# EAGLE design integrated (EAGLE 7.5.0)
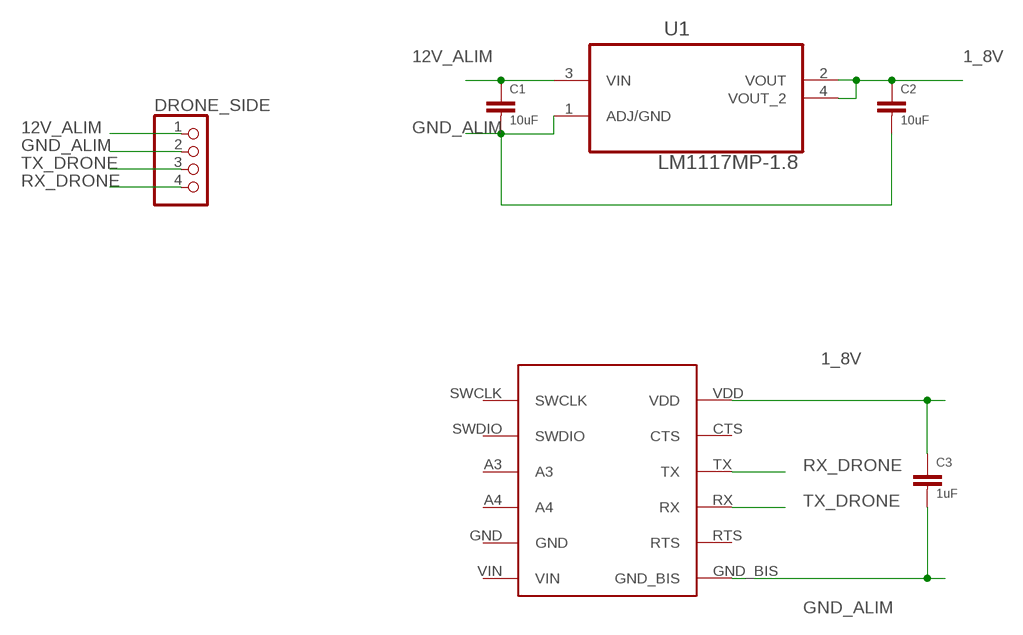
[diagram p0: schematic, sheet 1]

## Parts
C1  10uF  C_0805  [R0805]
C2  10uF  C_0805  [R0805]
C3  1uF  C_1206  [R1206]
DRONE_SIDE  PINHD-1X4  [1X04]
U1  LM1117MP-1.8  [SOT230P696X180-4N]
U$2  BLE_NANO  [MOUNTED_ON_PINHEADS]

## Nets
1_8V: C2.1 C3.1 U1.2(VOUT) U1.4(VOUT_2) U$2.VDD
12V_ALIM: C1.1 DRONE_SIDE.1 U1.3(VIN)
GND_ALIM: C1.2 C2.2 C3.2 DRONE_SIDE.2 U1.1(ADJ/GND) U$2.GND_BIS
RX_DRONE: DRONE_SIDE.4 U$2.TX
TX_DRONE: DRONE_SIDE.3 U$2.RX
Unconnected: U$2.A3 U$2.A4 U$2.CTS U$2.GND U$2.RTS U$2.SWCLK U$2.SWDIO U$2.VIN

## Library data of the parts
C1-C3 = @Club_passif:C_
DRONE_SIDE = pinhead:PINHD-1X4: PIN HEADER
U1 = lm1117:LM1117MP-1.8: IC REG LDO 800MA 1.8V; MPN: LM1117MP-1.8; OC_FARNELL: 1469053; OC_NEWARK: 41K3467; PACKAGE: SOT-223; SUPPLIER: National Semiconductor
U$2 = redbearlab:BLE_NANO

## Board
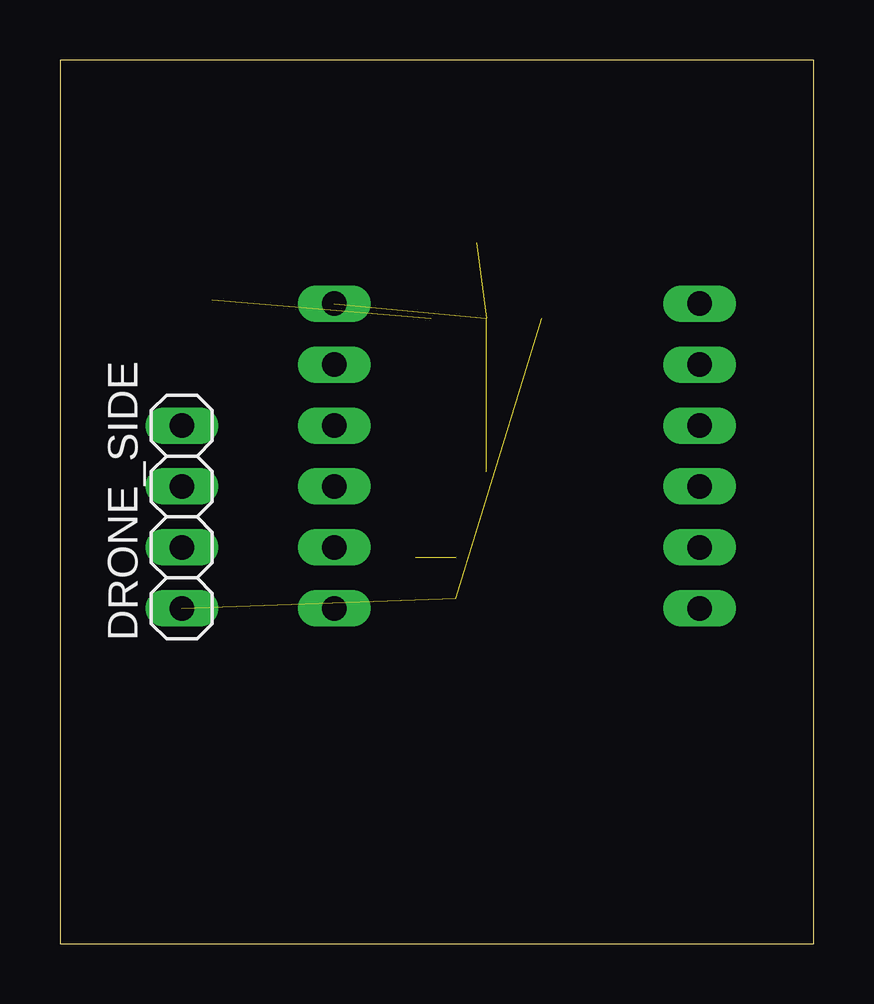
[diagram p1: board, top side]
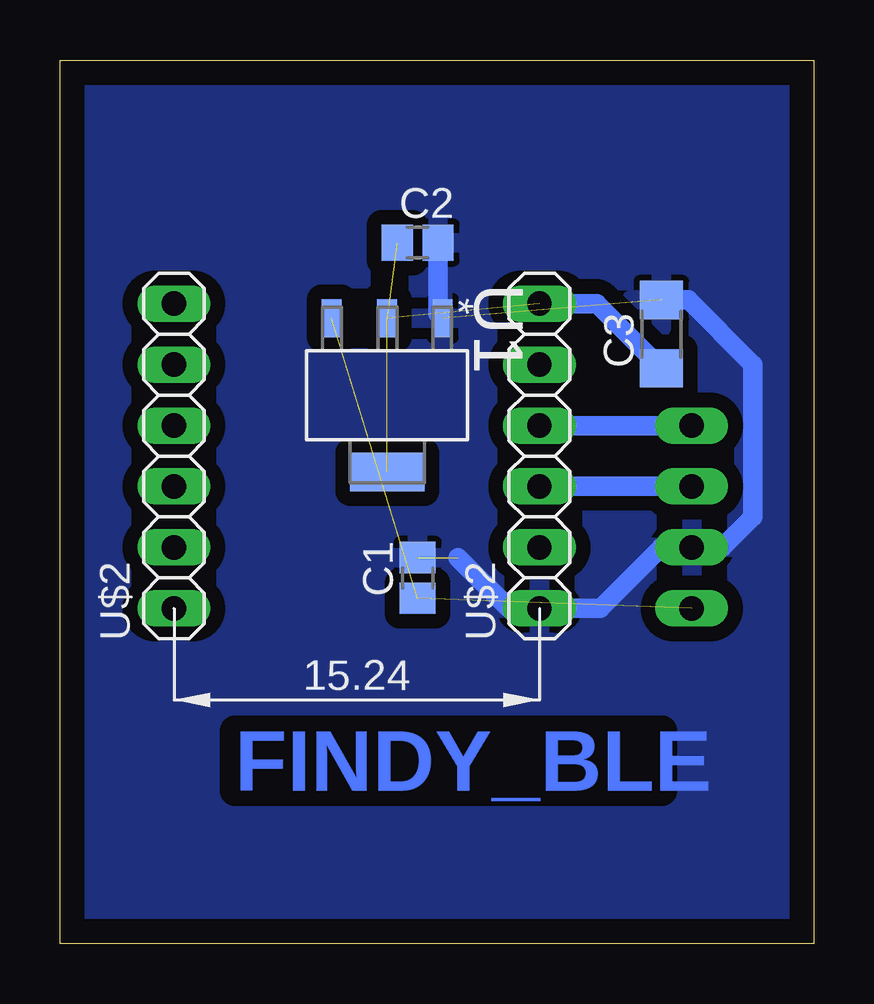
[diagram p2: board, bottom side, seen from below]

Size 31.42 x 36.82 mm. Coordinates in mm from the lower left corner, seen from the top.
Outline: 0,0 31.42,0 31.42,36.82 0,36.82 0,0
Copper layers (1*16): Top 0.035mm / dielectric 1.5mm / Bottom 0.035mm
Design rules "default": minimum track width 10mil, minimum drill 24mil, track to track 8mil, track to pad 8mil, pad to pad 8mil, via to via 8mil, smd to smd 8mil, copper to edge 40mil, drill to drill 8mil, minimum pad ring 10mil, minimum via ring 8mil, stop-mask expansion 4mil, vias tented up to drill 0mil, thermal gap 10mil

### Footprints (pad centres in the part's own frame; a part is rotated, then mirrored left to right if it is on the bottom)
R0805 = smd 1.3 x 1.5: 1 -0.85,0; 2 0.85,0
R1206 = smd 1.6 x 1.803: 1 -1.422,0; 2 1.422,0
1X04 = drill 1.016 long: 1 -3.81,0; 2 -1.27,0; 3 1.27,0; 4 3.81,0
SOT230P696X180-4N = smd 1.6 x 0.838: 1 -3.2,2.311; 2 -3.2,0; 3 -3.2,-2.311 | smd 1.6 x 3.099: 4 3.2,0
MOUNTED_ON_PINHEADS = drill 1.016 long: A3 -7.62,5.08; A4 -7.62,2.54; CTS 7.62,7.62; GND -7.62,0; GND_BIS 7.62,-2.54; RTS 7.62,0; RX 7.62,2.54; SWCLK -7.62,10.16; SWDIO -7.62,7.62; TX 7.62,5.08; VDD 7.62,10.16; VIN -7.62,-2.54

### Placement (x,y rotation side)
C1  16.51,15.24 90 bottom
C2  16.51,29.21 0 bottom
C3  6.35,25.4 90 bottom
DRONE_SIDE  5.08,17.78 90 top
U1  17.78,22.86 270 bottom
U$2  19.05,16.51 0 bottom

### Tracks (layer width: path | path; a pad name or v marks a point on that pad's centre or on a via)
1_8V  (3 unrouted)
  Bottom 0.813: U$2.VDD 9.04,26.67 C3.1
12V_ALIM  (2 unrouted)
GND_ALIM  (2 unrouted)
  Bottom 0.813: C3.2 5.23,26.82 2.54,24.13 2.54,17.78 3.81,16.51 DRONE_SIDE.2 6.35,16.51 8.89,13.97 U$2.GND_BIS 12.7,13.97 14.82,16.09 | C2.2 15.66,26.25 U1.1
  pour Bottom (isolate 0.61): -15.24,44.45 41.91,44.45 41.91,-3.81 -15.24,-3.81
RX_DRONE
  Bottom 0.813: DRONE_SIDE.4 U$2.TX
TX_DRONE
  Bottom 0.813: DRONE_SIDE.3 U$2.RX

### Text on the board
Bottom: FINDY_BLE